# EAGLE design USB Power Hub (EAGLE 6.6.0)
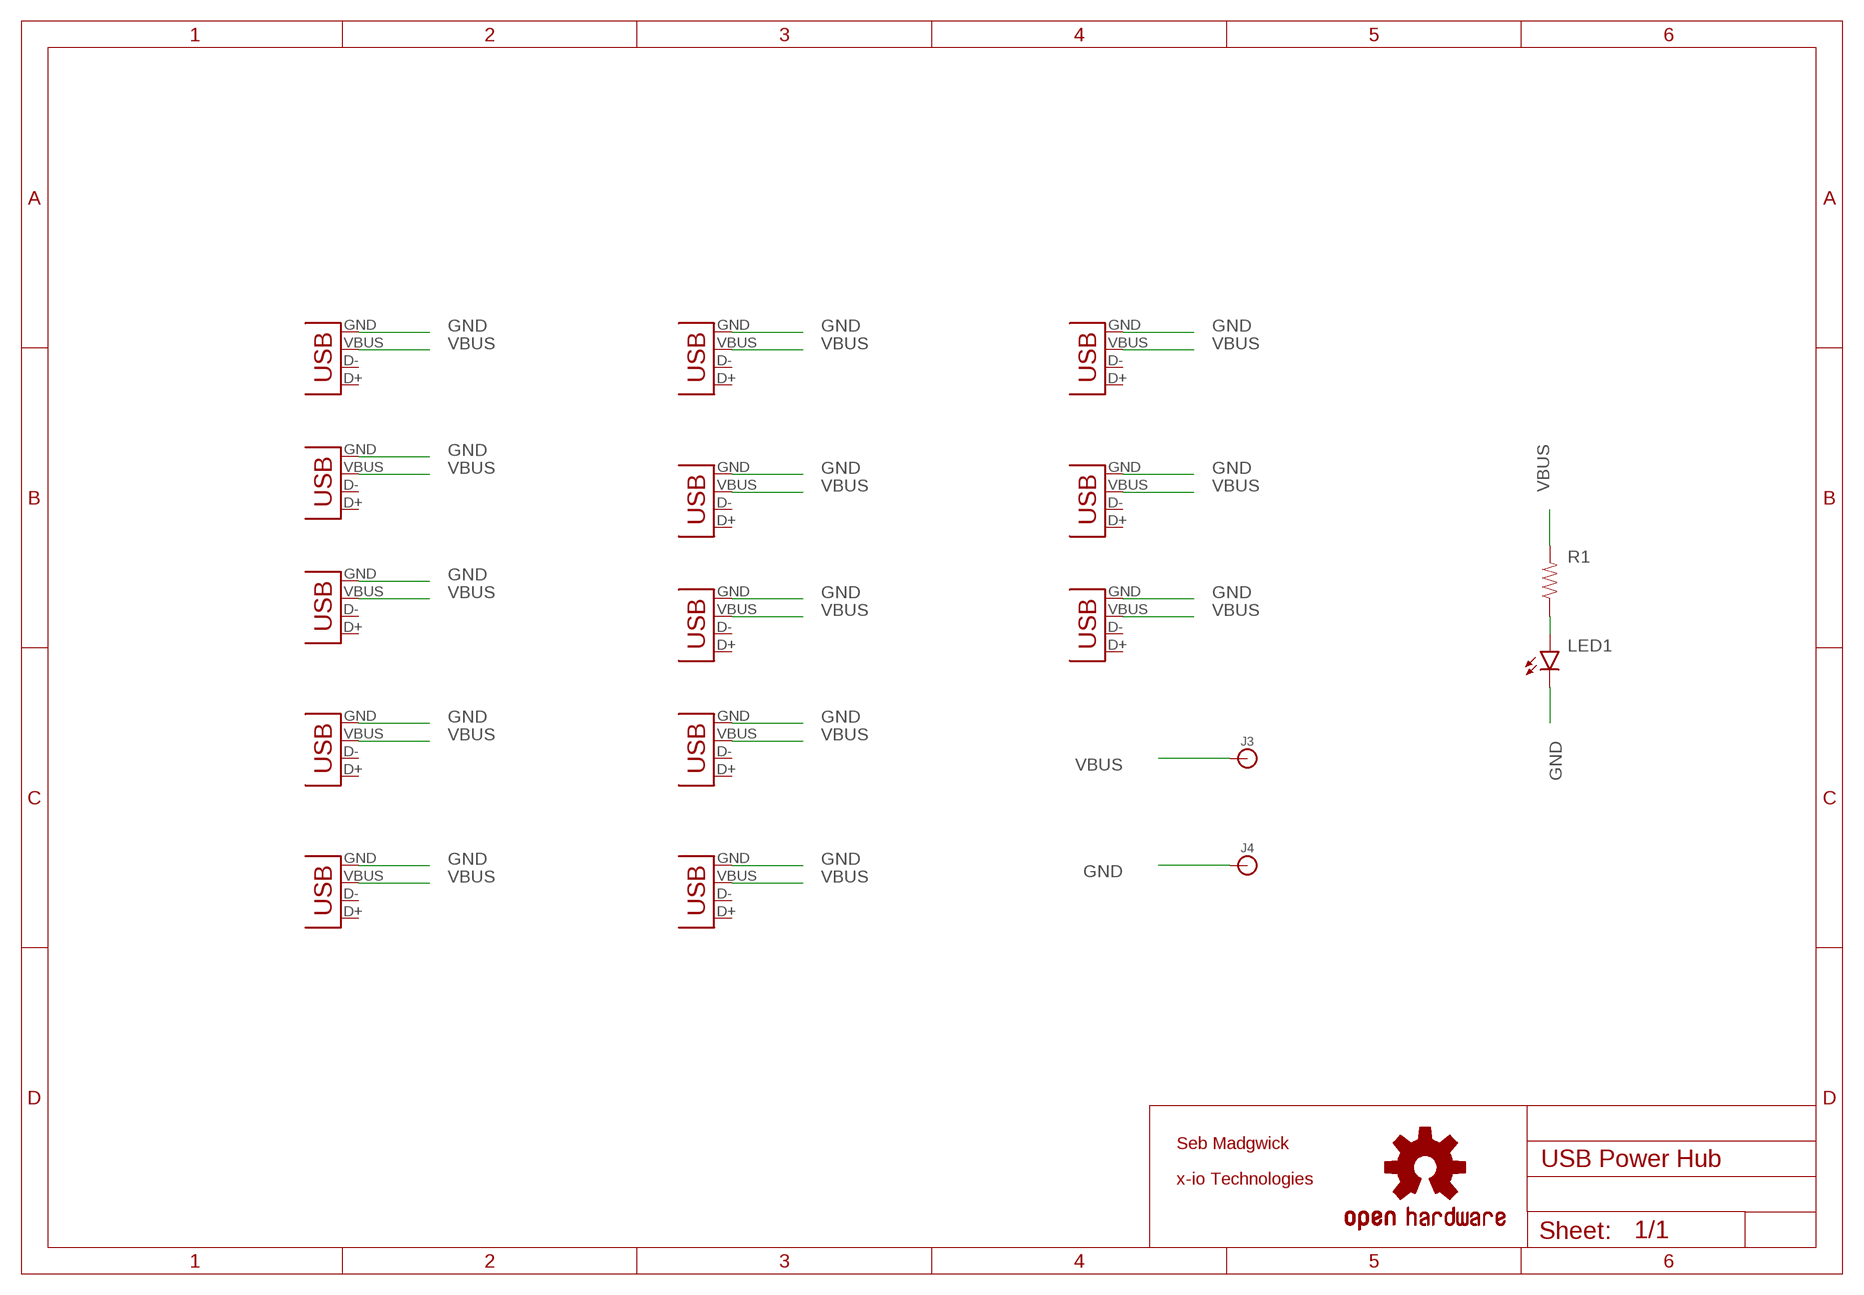
[diagram p0: schematic, sheet 1]

## Parts
J3  BANANA_CONN  [BANANA_CONN]
J4  BANANA_CONN  [BANANA_CONN]
JP1  USB-A-S  [USB-A-S]
JP2  USB-A-S  [USB-A-S]
JP3  USB-A-S  [USB-A-S]
JP4  USB-A-S  [USB-A-S]
JP5  USB-A-S  [USB-A-S]
JP6  USB-A-S  [USB-A-S]
JP7  USB-A-S  [USB-A-S]
JP8  USB-A-S  [USB-A-S]
JP9  USB-A-S  [USB-A-S]
JP10  USB-A-S  [USB-A-S]
JP11  USB-A-S  [USB-A-S]
JP12  USB-A-S  [USB-A-S]
JP13  USB-A-S  [USB-A-S]
LED1  LED5MM  [LED5MM]
LOGO1  OSHW-LOGOL  [OSHW-LOGO-L]
R1  RESISTOREZ  [AXIAL-0.3EZ]

## Nets
GND: J4.P$1 JP1.GND JP2.GND JP3.GND JP4.GND JP5.GND JP6.GND JP7.GND JP8.GND JP9.GND JP10.GND JP11.GND JP12.GND JP13.GND LED1.K(C)
N$3: LED1.A R1.P$1
VBUS: J3.P$1 JP1.VBUS JP2.VBUS JP3.VBUS JP4.VBUS JP5.VBUS JP6.VBUS JP7.VBUS JP8.VBUS JP9.VBUS JP10.VBUS JP11.VBUS JP12.VBUS JP13.VBUS R1.P$2
Unconnected: JP1.D+ JP1.D- JP2.D+ JP2.D- JP3.D+ JP3.D- JP4.D+ JP4.D- JP5.D+ JP5.D- JP6.D+ JP6.D- JP7.D+ JP7.D- JP8.D+ JP8.D- JP9.D+ JP9.D- JP10.D+ JP10.D- JP11.D+ JP11.D- JP12.D+ JP12.D- JP13.D+ JP13.D-

## Notes on the sheet
- Seb Madgwick
- x-io Technologies

## Library data of the parts
J3 J4 = SparkFun-Connectors:BANANA_CONN: Through-hole banana jack
JP1-JP13 = SparkFun-Connectors:USB: USB Connectors USB-B-PTH is fully proven SKU : PRT-00139/CONN-08278 USB-miniB is fully proven SKU : PRT-00587 USB-A-PCB is untested. USB-A-H is throughly reviewed, but untested. Spark Fun Electronics SKU : PRT-00437 USB-B-SMT is throughly reviewed, but untested. Needs silkscreen touching up. USB-A-S has not been used/tested USB-MB-H has not been used/tested USB-MICROB has been used. CONN-09505
LED1 = SparkFun-LED:LED: LEDs Standard schematic elements and footprints for 5mm, 3mm, 1206, and 0603 sized LEDs. 5mm - Spark Fun Electronics SKU : COM-00529 (and others)
LOGO1 = SparkFun-Aesthetics:OSHW-LOGO: Open Source Hardware Logo This logo indicates the piece of hardware it is found on incorporates a OSHW license and/or adheres to the definition of open source hardware found here: http://freedomdefined.org/OSHW
R1 = SparkFun-Passives:RESISTOR: Resistor Basic schematic elements and footprints for 0603, 1206, and PTH resistors.

## Board
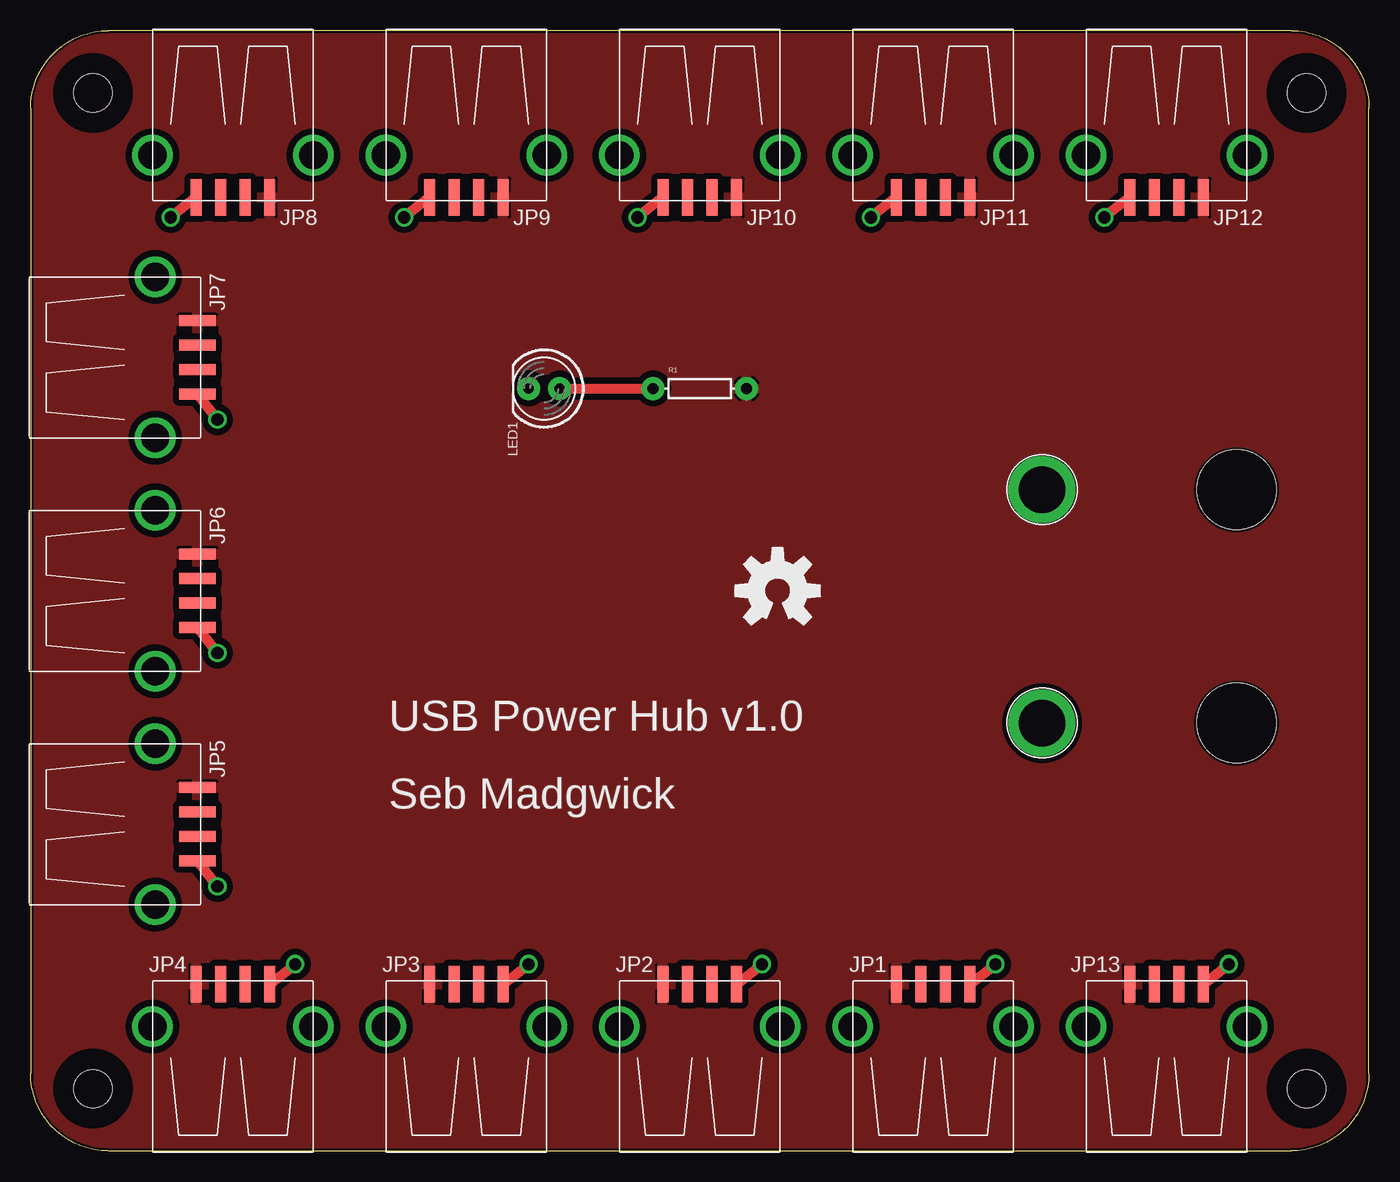
[diagram p1: board, top side]
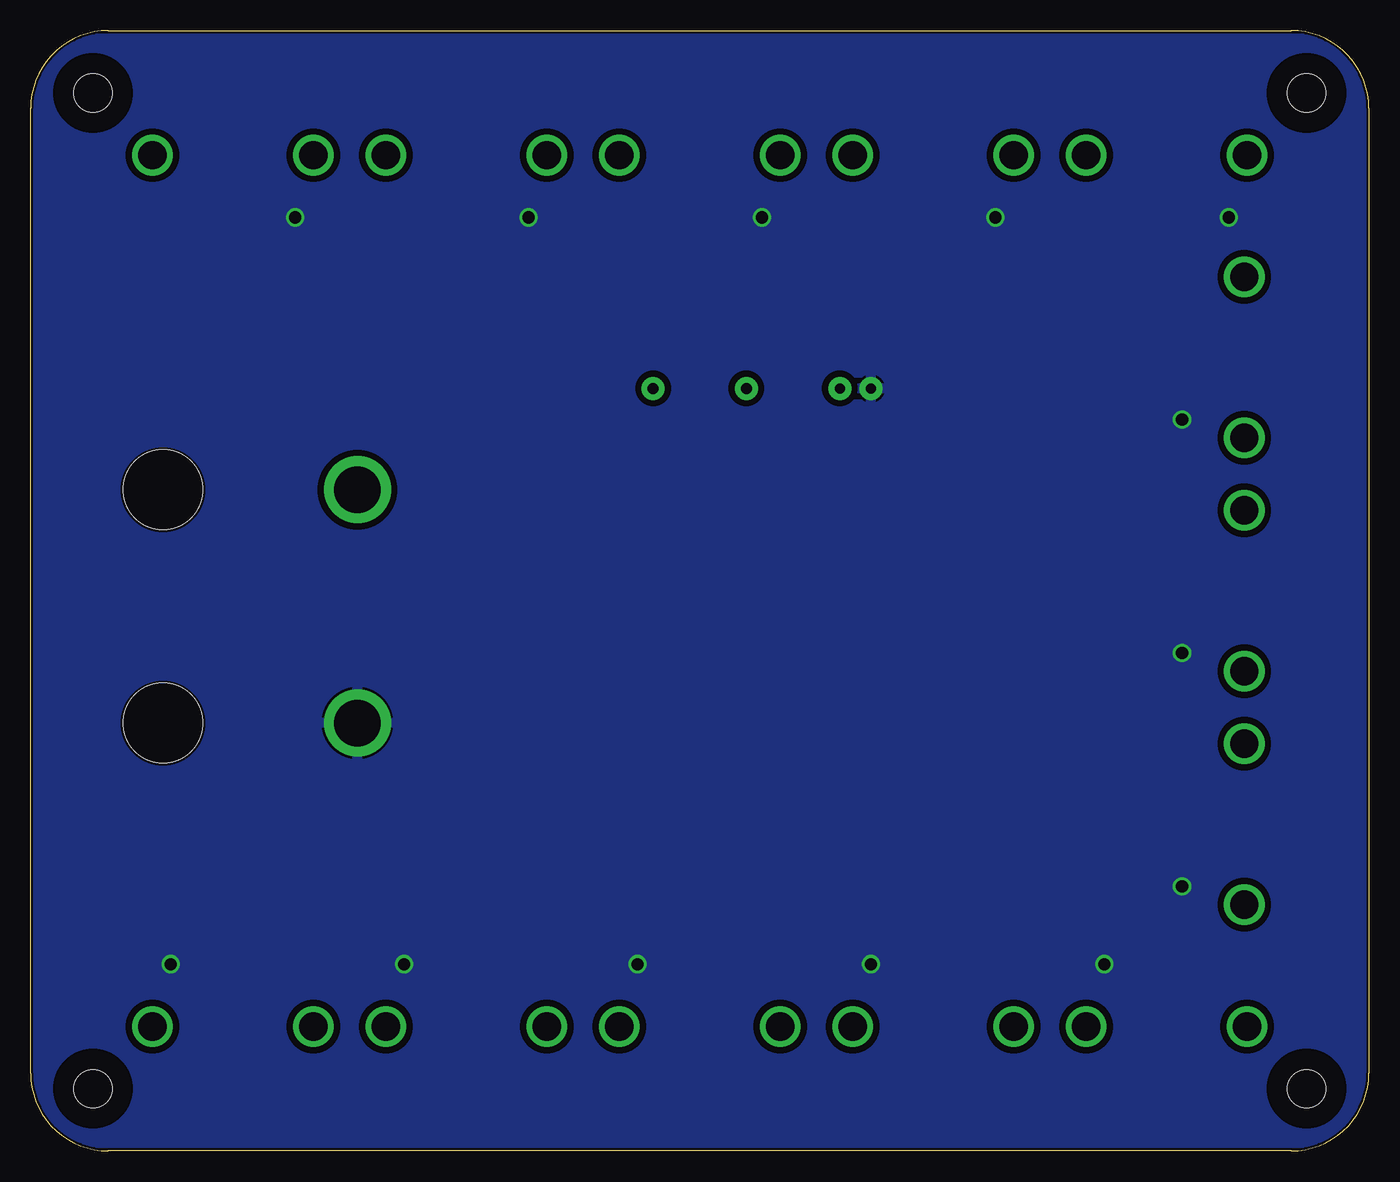
[diagram p2: board, bottom side, seen from below]

Size 109.22 x 91.44 mm. Coordinates in mm from the lower left corner, seen from the top.
Outline: 6.35,0 102.87,0 arc90 109.22,6.35 109.22,85.09 arc90 102.87,91.44 6.35,91.44 arc90 0,85.09 0,6.35 arc90 6.35,0
Copper layers (1*16): Top 0.035mm / dielectric 1.5mm / Bottom 0.035mm
Design rules "default *": minimum track width 6mil, minimum drill 13mil, track to track 20mil, track to pad 20mil, pad to pad 20mil, via to via 20mil, smd to smd 0.5mm, copper to edge 0.2mm, drill to drill 0.15mm, minimum pad ring 10mil, minimum via ring 8mil, stop-mask expansion 4mil, vias tented up to drill 1mm, thermal gap 0.195mm
Holes 3.1 mm at 5.08,86.36 104.14,86.36 5.08,5.08 104.14,5.08
Holes 6.5 mm at 98.42,53.98 98.42,34.92
tRestrict: area 2.2,83.5 to 7.9,89.2; area 101.3,83.5 to 107,89.2; area 2.2,2.2 to 7.9,7.9; area 101.3,2.2 to 107,7.9
bRestrict: area 2.2,83.5 to 7.9,89.2; area 101.3,83.5 to 107,89.2; area 2.2,2.2 to 7.9,7.9; area 101.3,2.2 to 107,7.9

### Footprints (pad centres in the part's own frame; a part is rotated, then mirrored left to right if it is on the bottom)
BANANA_CONN = drill 3.81 pad 5.461: P$1 0,0
USB-A-S = smd 3 x 0.9: D+ 3.45,-1; D- 3.45,1; GND 3.45,-3; VBUS 3.45,3 | drill 2.311: P$5 0,-6.566; P$6 0,6.566
LED5MM = drill 0.813 pad 1.88: A -1.27,0; K 1.27,0
AXIAL-0.3EZ = drill 0.9 pad 1.88: P$1 -3.81,0; P$2 3.81,0

### Placement (x,y rotation side)
J3  82.55,53.98 0 top
J4  82.55,34.92 0 top
JP1  73.66,10.16 90 top
JP2  54.61,10.16 90 top
JP3  35.56,10.16 90 top
JP4  16.51,10.16 90 top
JP5  10.16,26.67 0 top
JP6  10.16,45.72 0 top
JP7  10.16,64.77 0 top
JP8  16.51,81.28 270 top
JP9  35.56,81.28 270 top
JP10  54.61,81.28 270 top
JP11  73.66,81.28 270 top
JP12  92.71,81.28 270 top
JP13  92.71,10.16 90 top
LED1  41.91,62.23 180 top
LOGO1  60.96,45.72 0 top
R1  54.61,62.23 0 top
U$2  [X-IO_TECHNOLOGIES_LOGO_20MM_TOP]  29.21,40.64 0 top

### Tracks (layer width: path | path; a pad name or v marks a point on that pad's centre or on a via)
GND  (via drill 1)
  Top 0.813: JP8.GND v11.43,76.2 | JP9.GND v30.48,76.2 | JP10.GND v49.53,76.2 | JP11.GND v68.58,76.2 | JP12.GND v87.63,76.2 | JP7.GND v15.24,59.69 | JP6.GND v15.24,40.64 | JP5.GND v15.24,21.59 | JP4.GND v21.59,15.24 | JP3.GND v40.64,15.24 | JP2.GND v59.69,15.24 | JP1.GND v78.74,15.24 | JP13.GND v97.79,15.24
  pour Bottom: 0,0 109.22,0 109.22,91.44 0,91.44
N$3
  Top 0.813: LED1.A R1.P$1
VBUS
  pour Top: 0,0 109.22,0 109.22,91.44 0,91.44

### Text on the board
_tsilk: USB Power Hub v1.0 | Seb Madgwick